# Altium schematic sheet Sheet_1_2026-06-06.schdoc
size 202 x 219 mm
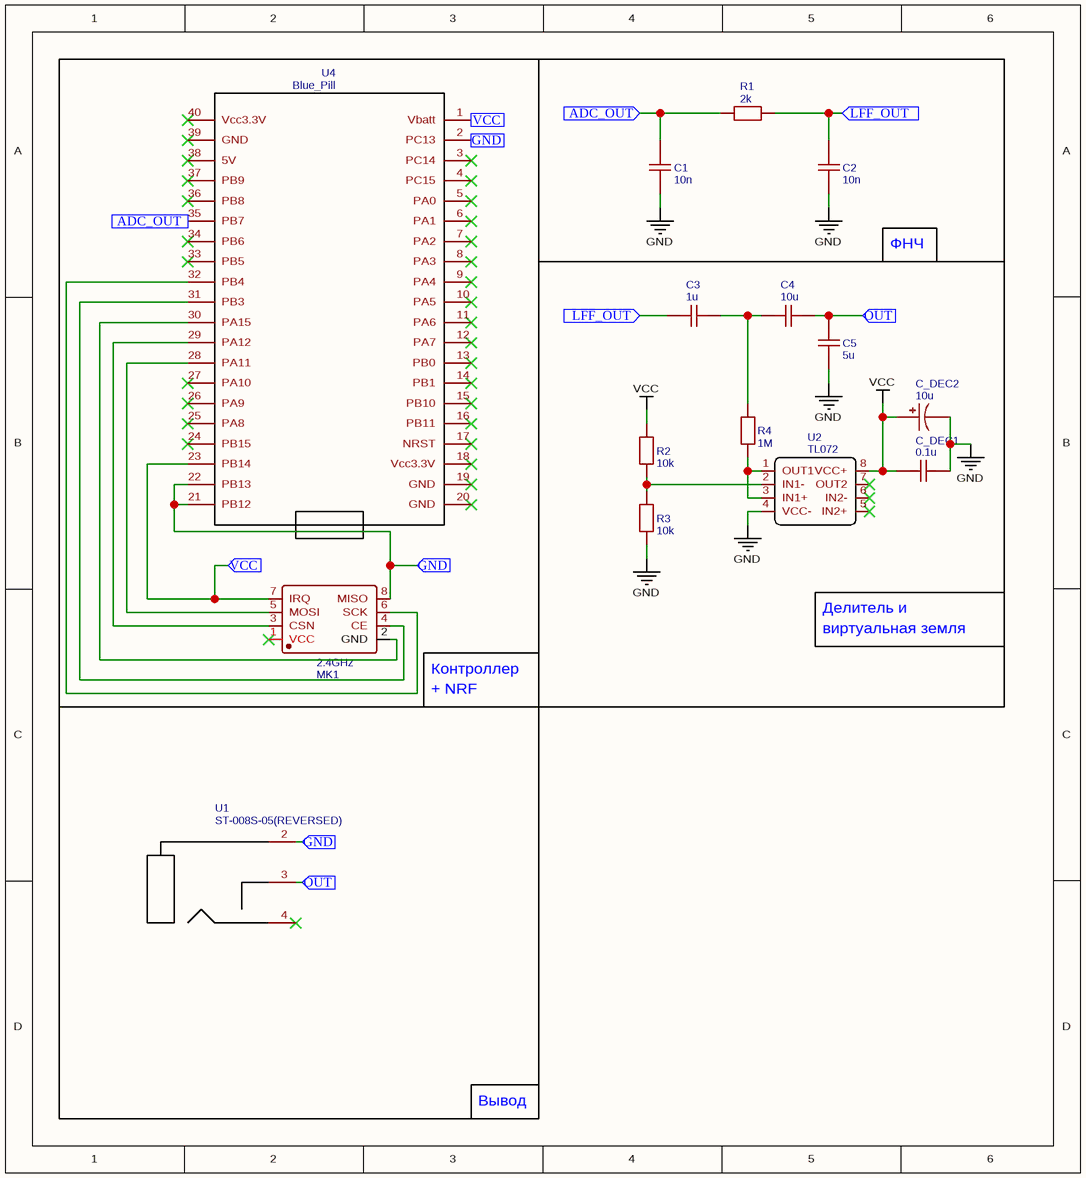
[diagram p0: Sheet_1_2026-06-06.schdoc]

## Parts
C1  10n  [C0603]
C2  10n  [C0603]
C3  1u  [C0603]
C4  10u  [C0603]
C5  5u  [C0603]
C_DEC1  0.1u  [C0603]
C_DEC2  10u  [CAP-D3.0×F1.5]
MK1  2.4GHz  [WIRELM-SMD_L28.6-W15.3-P2.54_NRF24L01]
R1  2k  [R0603]
R2  10k  [R0603]
R3  10k  [R0603]
R4  1M  [R0603]
U1  ST-008S-05(REVERSED)  [ST-008S-05(REVERSED)]
U2  TL072  [TL072]
U4  Blue_Pill  [STM32F103C8T6-BLUEPILL 1]

## Blocks framed on the sheet
ФНЧ: C1 C2 R1

## Ports
ADC_OUT (in), GND (in), LFF_OUT (in), OUT (in), VCC (in)

## Nets
GND: C1.1 C2.1 C5.2 C_DEC1.2 C_DEC2.2 R3.1 U2.4(VCC-)
VCC: C_DEC1.1 C_DEC2.1 R2.1 U2.8(VCC+)
ADC_OUT: C1.2 R1.1 U4.35(PB7) ; port ADC_OUT
GND: MK1.8(MISO) U1.2 U4.2(PC13) U4.21(PB12) U4.22(PB13) ; port GND  [a separate net that carries the same name]
LFF_OUT: C2.2 C3.2 R1.2 ; port LFF_OUT
OUT: C4.1 C5.1 U1.3 ; port OUT
VCC: MK1.7(IRQ) U4.1(Vbatt) U4.23(PB14) ; port VCC  [a separate net that carries the same name]
NetC3_1: C3.1 C4.2 R4.1
NetMK1_2: MK1.2(GND) U4.30(PA15)
NetMK1_3: MK1.3(CSN) U4.29(PA12)
NetMK1_4: MK1.4(CE) U4.31(PB3)
NetMK1_5: MK1.5(MOSI) U4.28(PA11)
NetMK1_6: MK1.6(SCK) U4.32(PB4)
NetR2_2: R2.2 R3.2 U2.2(IN1-)
NetR4_2: R4.2 U2.1(OUT1) U2.3(IN1+)

Not connected (* = marked no-connect by the designer): MK1 1(VCC)*; U1 4*; U2 5(IN2+)* 6(IN2-)* 7(OUT2)*; U4 3(PC14)* 4(PC15)* 5(PA0)* 6(PA1)* 7(PA2)* 8(PA3)* 9(PA4)* 10(PA5)* 11(PA6)* 12(PA7)* 13(PB0)* 14(PB1)* 15(PB10)* 16(PB11)* 17(NRST)* 18(Vcc3.3V)* 19(GND)* 20(GND)* 24(PB15)* 25(PA8)* 26(PA9)* 27(PA10)* 33(PB5)* 34(PB6)* 36(PB8)* 37(PB9)* 38(5V)* 39(GND)* 40(Vcc3.3V)*

## Notes on the sheet
- Делитель и
- виртуальная земля
- Контроллер
- + NRF
- Вывод

## Library data of the parts
C1 C2 = 10n: nameAlias: Value(F); Contributor: LCEDA_Lib; spicePre: C; spiceSymbolName: C_0603_US
C3 = 1u: nameAlias: Value(F); Contributor: LCEDA_Lib; spicePre: C; spiceSymbolName: C_0603_US
C4 C_DEC2 = 10u: nameAlias: Value(F); Contributor: LCEDA_Lib; spicePre: C
  C4: spiceSymbolName: C_0603_US
  C_DEC2: spiceSymbolName: CE_TH_D3.0×F1.5_US
C5 = 5u: nameAlias: Value(F); Contributor: LCEDA_Lib; spicePre: C; spiceSymbolName: C_0603_US
C_DEC1 = 0.1u: nameAlias: Value(F); Contributor: LCEDA_Lib; spicePre: C; spiceSymbolName: C_0603_US
MK1 = 2.4GHz: Manufacturer: Ai-Thinker(安信可); Manufacturer Part: NF-04; nameAlias: Value; Supplier: LCSC; Supplier Part: C90751; JLCPCB Part Class: Extended Part; spicePre: M; spiceSymbolName: NRF24L01
R1 = 2k: nameAlias: Value(Ω); Contributor: LCEDA_Lib; spicePre: R; spiceSymbolName: R_0603_EU
R2 R3 = 10k: nameAlias: Value(Ω); Contributor: LCEDA_Lib; spicePre: R; spiceSymbolName: R_0603_EU
R4 = 1M: nameAlias: Value(Ω); Contributor: LCEDA_Lib; spicePre: R; spiceSymbolName: R_0603_EU
U1 = ST-008S-05(REVERSED): Contributor: danik_mus; spicePre: U; spiceSymbolName: ST-008S-05(REVERSED)
U2 = TL072: Contributor: dmitrukvoloda; spicePre: U; spiceSymbolName: TL072
U4 = Blue_Pill: Manufacturer Part: STM32Duino; Contributor: gianpysurf; spicePre: U; spiceSymbolName: Blue_Pill